# EAGLE schematic Constant Current (EAGLE 6.3)

## Sheet 1 of 6: Anode 1
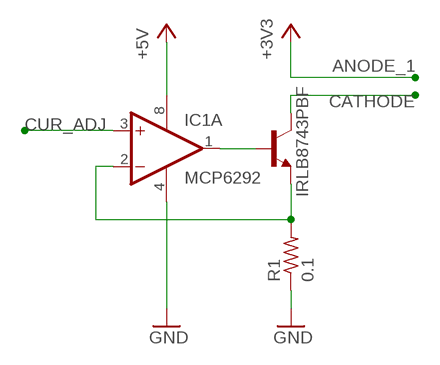
[diagram p0: schematic, sheet 1]

### Parts
IC1  MCP6292  2AMP_P8+4D  [SO08]
R1  0.1  R-US_R1206  [R1206]
T1  IRLB8743PBF  2SC1306  [TO220BV]

### Nets
+5V: IC1.8(P:V+) ; also sheet 3
CATHODE: T1.2(C) ; also sheet 2
CUR_ADJ: IC1.3(A:+IN) ; also sheet 2,3
GND: IC1.4(P:V-) R1.1 ; also sheet 2,3
N$1: IC1.2(A:-IN) R1.2 T1.3(E)
N$3: IC1.1(A:OUT) T1.1(B)

## Sheet 2 of 6: Anode 2
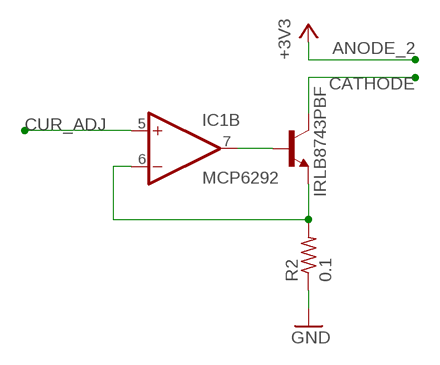
[diagram p1: schematic, sheet 2]

### Parts
R2  0.1  R-US_R1206  [R1206]
T2  IRLB8743PBF  2SC1306  [TO220BV]

### Nets
CATHODE: T2.2(C) ; also sheet 1
CUR_ADJ: IC1.5(B:+IN) ; also sheet 1,3
GND: R2.1 ; also sheet 1,3
N$5: IC1.6(B:-IN) R2.2 T2.3(E)
N$6: IC1.7(B:OUT) T2.1(B)

## Sheet 3 of 6: DC Input
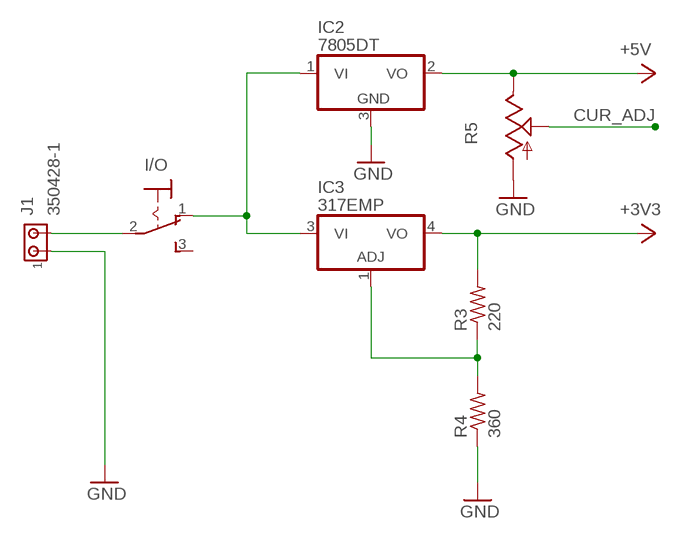
[diagram p2: schematic, sheet 3]

### Parts
I/O  M9040P  [M9040P]
IC2  7805DT  [TO252]
IC3  317EMP  [SOT223]
J1  350428-1  [350428-1]
R3  220  R-US_M1206  [M1206]
R4  360  R-US_M1206  [M1206]
R5  TRIM_US-RJ9W  [RJ9W]

### Nets
+3V3: IC3.4(VO) R3.2
+5V: IC2.2(VO) R5.E ; also sheet 1
CUR_ADJ: R5.S ; also sheet 1,2
GND: IC2.3(GND) J1.1 R4.1 R5.A ; also sheet 1,2
N$2: I/O.2(P) J1.2
N$4: IC3.1(ADJ) R3.1 R4.2
N$8: I/O.1(O) IC2.1(VI) IC3.3(VI)
Unconnected: I/O.3(S)

## Sheet 4 of 6: Timer circuit

## Sheet 5 of 6: Output
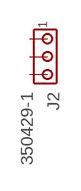
[diagram p3: schematic, sheet 5]

### Parts
J2  350429-1  [350429-1]
Unconnected: J2.1 J2.2 J2.3

## Sheet 6 of 6: NOTES: Use relay for switching LEDS for current output 555 and relay for pulse plating (turn off able) bannana jack output plugs? large heat sink required

## Library data of the parts
I/O = switch:M9040P: TOGGLE SWITCH Marquardt
IC1 = linear:2AMP_P8+4: OP AMP
IC2 = linear:78*: Positive VOLTAGE REGULATOR Source: http://cache.national.com/ds/LM/LM78L05.pdf http://www.fairchildsemi.com/ds/LM/LM7805.pdf
IC3 = linear:*317: Positive VOLTAGE REGULATOR
J1 = con-amp:350428-1: Universal MATE-N-LOK .250" Centerline, 600 V, 19 - 36 A max Source: http://catalog.tycoelectronics.com/ .. ENG_CD_350428_Y.pdf
J2 = con-amp:350429-1: Universal MATE-N-LOK .250" Centerline, 600 V, 19 - 36 A max Source: http://catalog.tycoelectronics.com/ .. ENG_CD_350429_Y.pdf
R1-R4 = rcl:R-US_: RESISTOR, American symbol
R5 = pot:TRIM_US-: POTENTIOMETER
T1 T2 = transistor:2SC1306: NPN Transistor Final RF Power Outupt Source: 2sc1306.pdf